# Altium schematic sheet 7_dc_dc_3V3_3V3_Deployment_ANT.SchDoc: OBDH Step-Down 3V3/1A/2A
size A4; DrawnBy: Sara V. Martínez; Engineer: Flight; DocumentNumber: 10; Revision: V0.1; SheetNumber: 10; SheetTotal: 11
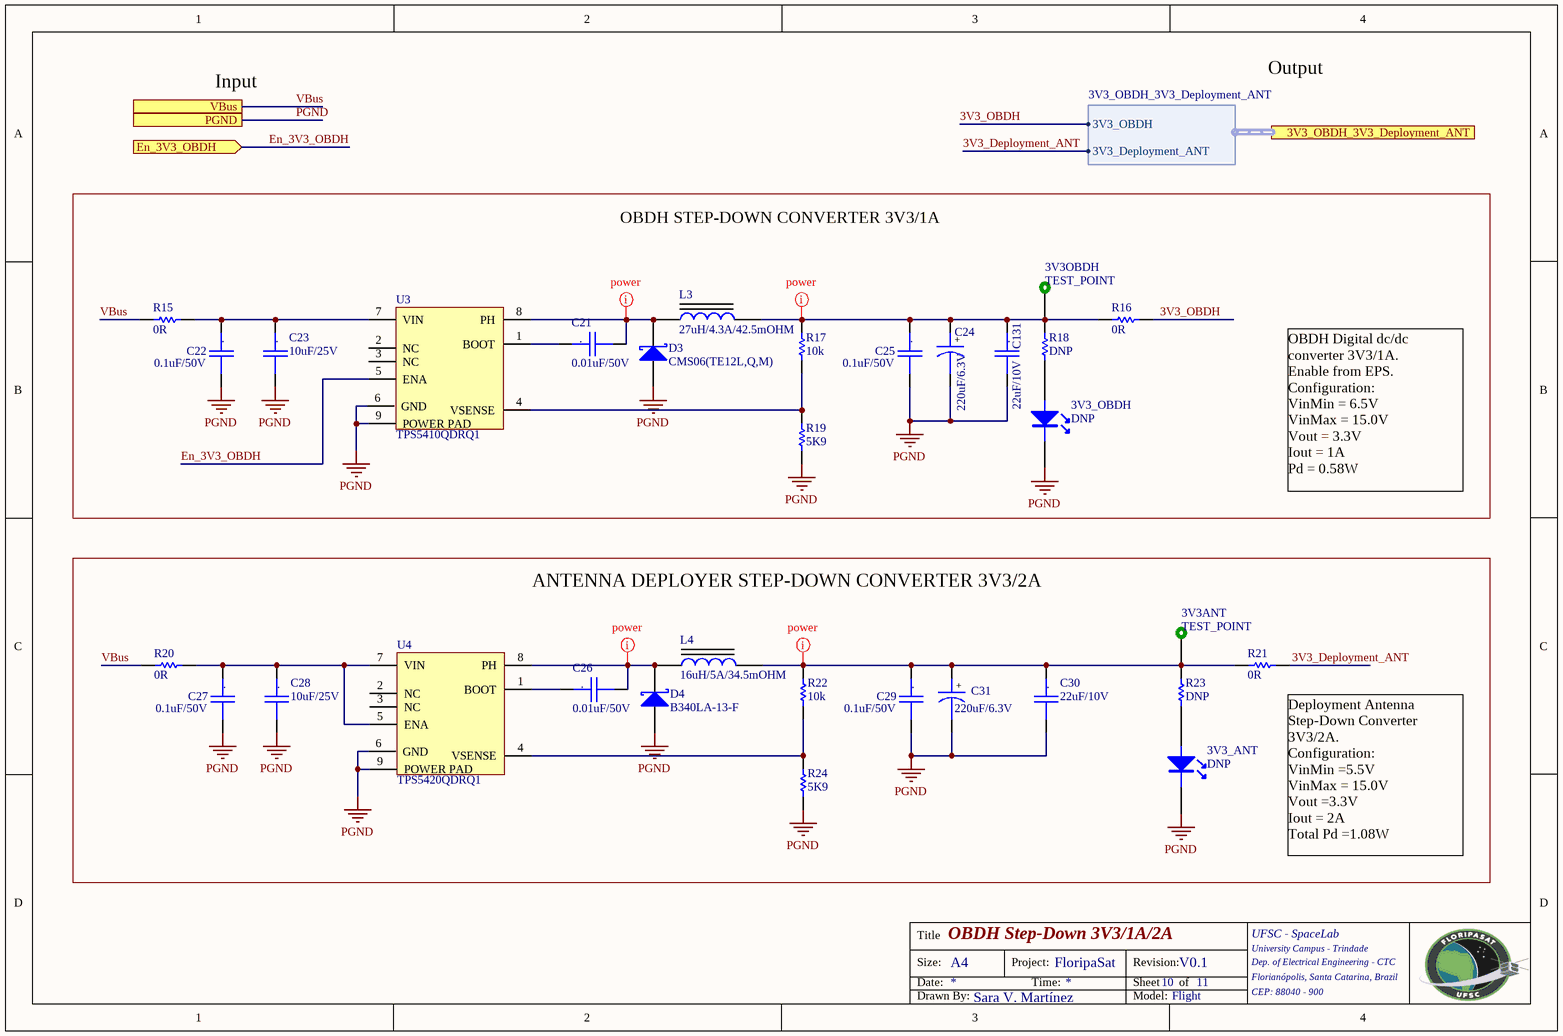
[diagram p0: 7_dc_dc_3V3_3V3_Deployment_ANT.SchDoc]

## Parts
3V3_ANT  DNP  [0603-LED]
3V3_OBDH  DNP  [0603-LED]
3V3ANT  TEST_POINT  [TEST_POINT]  (no BOM)
3V3OBDH  TEST_POINT  [TEST_POINT]  (no BOM)
C21  0.01uF/50V  [CC0805]
C22  0.1uF/50V  [CC0805]
C23  10uF/25V  [CC1206]
C24  220uF/6.3V  [cc1210]
C25  0.1uF/50V  [CC0805]
C26  0.01uF/50V  [CC0805]
C27  0.1uF/50V  [CC0805]
C28  10uF/25V  [CC1206]
C29  0.1uF/50V  [CC0805]
C30  22uF/10V  [CC1206]
C31  220uF/6.3V  [cc1210]
C131  22uF/10V  [CC1206]
D3  CMS06(TE12L,Q,M)  [cms06]
D4  B340LA-13-F  [DO-214AC]
L3  27uH/4.3A/42.5mOHM  [IND_744325xxx]
L4  16uH/5A/34.5mOHM  [IND_744325xxx]
R15  0R  [1206]
R16  0R  [1206]
R17  10k  [0805]
R18  DNP  [0603]
R19  5K9  [0805]
R20  0R  [1206]
R21  0R  [1206]
R22  10k  [0805]
R23  DNP  [0603]
R24  5K9  [0805]
U3  TPS5410QDRQ1  [SO8 Power PAD]
U4  TPS5420QDRQ1  [SO8 Power PAD]

## Blocks framed on the sheet
OBDH STEP-DOWN CONVERTER 3V3/1A: 3V3_OBDH 3V3OBDH C21-C25 C131 D3 L3 R15-R19 U3
ANTENNA DEPLOYER STEP-DOWN CONVERTER 3V3/2A: 3V3_ANT 3V3ANT C26-C31 D4 L4 R20-R24 U4

## Ports
3V3_OBDH_3V3_Deployment_ANT (harness 3V3_OBDH_3V3_Deployment_ANT), En_3V3_OBDH (in), PGND, VBus

## Harnesses
3V3_OBDH_3V3_Deployment_ANT: 3V3_OBDH, 3V3_Deployment_ANT

## Nets
PGND: 3V3_ANT.2(K) 3V3_OBDH.2(K) C22.2 C23.2 C24.2 C25.2 C27.2 C28.2 C29.2 C30.2 C31.2 C131.2 D3.2(A) D4.2(A) R19.1 R24.1 U3.6(GND) U3.9(POWER_PAD) U4.6(GND) U4.9(POWER_PAD) ; port PGND
3V3_Deployment_ANT: R21.1 ; port 3V3_OBDH_3V3_Deployment_ANT.3V3_Deployment_ANT
3V3_OBDH: R16.1 ; port 3V3_OBDH_3V3_Deployment_ANT.3V3_OBDH
En_3V3_OBDH: U3.5(ENA) ; port En_3V3_OBDH
VBus: R15.2 R20.2 ; port VBus
Net3V3_ANT_1: 3V3_ANT.1(A) R23.2
Net3V3_OBDH_1: 3V3_OBDH.1(A) R18.2
Net3V3ANT_1: 3V3ANT.1 C29.1 C30.1 C31.1 L4.2 R21.2 R22.2 R23.1
Net3V3OBDH_1: 3V3OBDH.1 C24.1 C25.1 C131.1 L3.2 R16.2 R17.2 R18.1
NetC21_1: C21.1 U3.1(BOOT)
NetC21_2: C21.2 D3.1(K) L3.1 U3.8(PH)
NetC22_1: C22.1 C23.1 R15.1 U3.7(VIN)
NetC26_1: C26.1 U4.1(BOOT)
NetC26_2: C26.2 D4.1(K) L4.1 U4.8(PH)
NetC27_1: C27.1 C28.1 R20.1 U4.5(ENA) U4.7(VIN)
NetR17_1: R17.1 R19.2 U3.4(VSENSE)
NetR22_1: R22.1 R24.2 U4.4(VSENSE)

Not connected (* = marked no-connect by the designer): U3 2(NC) 3(NC); U4 2(NC) 3(NC)

## Layout directives
net class power: Net3V3ANT_1, Net3V3OBDH_1, NetC21_2, NetC26_2

## Notes on the sheet
- Input
- Output
- OBDH Digital dc/dc converter 3V3/1A.
  Enable from EPS.
  Configuration:
  VinMin = 6.5V
  VinMax = 15.0V
  Vout = 3.3V
  Iout = 1A
  Pd = 0.58W
- (near R21) Deployment Antenna Step-Down Converter 3V3/2A.
  Configuration:
  VinMin =5.5V
  VinMax = 15.0V
  Vout =3.3V
  Iout = 2A
  Total Pd =1.08W
- Title
- Size:
- Date:
- A4
- Project:
- Time:
- FloripaSat
- Revision:
- Sheet
- of
- UFSC - SpaceLab
- University Campus - Trindade
- Dep. of Electrical Engineering - CTC
- Florianópolis, Santa Catarina, Brazil
- Drawn By:
- Model:
- CEP: 88040 - 900
- (in symbol Cap_Cer_X7R_0.01uF_50V_0805) .
- (in symbol Cap_Cer_X7R_0.1uF_50V_0805) .
- (in symbol Cap_Cer_X7R_10uF_25V_1206) .
- (in symbol Cap_Cer_X7R_22uF_10V_1206) .
- (in symbol Cap_Tant_SMD_220uF_6.3V_1210) +

## Library data of the parts
3V3_ANT 3V3_OBDH = LED/G_0603: SMD Green LED; Partnumber: 150060VS75000; NCM: 8541.40.21
3V3ANT 3V3OBDH = TEST_POINT: Test point
C21 C26 = Cap_Cer_X7R_0.01uF_50V_0805: CAP CER 0.01uF 50V 10% X7R 0805; Partnumber: 08055C103KAT4A; NCM: 8532.24.10
C22 C25 C27 C29 = Cap_Cer_X7R_0.1uF_50V_0805: CAP CER 0.1UF 50V 10% X7R 0805; Partnumber: CC0805KRX7R9BB104
C23 C28 = Cap_Cer_X7R_10uF_25V_1206: CAP CER 10uF 25V 10% X7R 1206; Partnumber: GRM31CR71E106KA12L; NCM: 8532.24.10
C24 C31 = Cap_Tant_SMD_220uF_6.3V_1210: CAP Tantalum 220uF 6.3V 20% 1210; Partnumber: 6TPE220MAZB; NCM: 8532.21.11
C30 C131 = Cap_Cer_X7R_22uF_10V_1206: CAP CER 22uF 10V 10% X7R 1206; Partnumber: GRM31CR71A226KE15L; NCM: 8532.24.10
D3 = DIODE_SCHOTTKY_30V_2A_  CMS06(TE12L,Q,M): DIODE SCHOTTKY 30V 2A   CMS06(TE12L,Q,M); NCM: 8541.10.29; Partnumber: CMS06(TE12L,Q,M)
D4 = DIODE_SCHOTTKY_40V_3A_B340LA-13-F: DIODE SCHOTTKY 40V 3A B340LA-13-F; NCM: 8541.10.29; Partnumber: B340LA-13-F
L3 = IND_POWER_27uH_4.3A_42.5mR: INDUCTOR 27UH 4.3A SMD; Partnumber: 7447798271; NCM: 8504.50.00
L4 = IND_POWER_16uH_5A_35.5mR: INDUCTOR 16UH 5A SMD; Partnumber: 7443251600; NCM: 8504.50.00
R15 R16 R20 R21 = R0R_JUMPER_3/4W_1206: RES 0.0 OHM 3/4W JUMP 1206; Partnumber: HCJ1206ZT0R00
R17 R22 = R10k_1%_1/8W_0805: RES 10K OHM 1/8W 1%  0805; Partnumber: CRCW080510K0FKEA; NCM: 8533.21.20
R18 R23 = R1.0k_1%_1/8W_0603: RES 1.0K OHM 1/8W 1% 0603; Partnumber: MCT06030C1001FP500; NCM: 8533.21.20
R19 R24 = R5.9K_1%_1/8W_0805: RES 5K9 OHM 1/8W 1% 0805; Partnumber: 71-CRCW0805-5.9K-E3; NCM: 8533.21.20
U3 = TPS5410QDRQ1: Partnumber: TPS5410QDRQ1
U4 = TPS5420QDRQ1: Partnumber: TPS5420QDRQ1